# Altium schematic sheet POWER_2.5V_3A.SchDoc
size A4
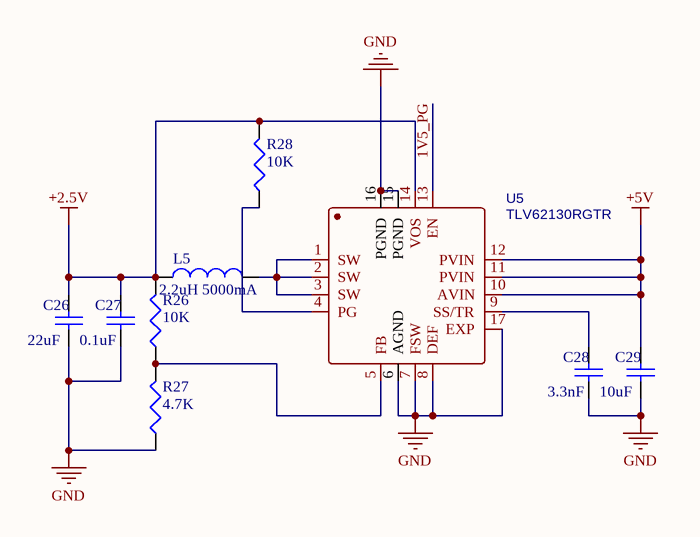
[diagram p0: POWER_2.5V_3A.SchDoc]

## Parts
C26  value 22uF  [C1210]  (hidden comment: Cap Semi)
C27  value 0.1uF  [C1210]  (hidden comment: Cap Semi)
C28  value 3.3nF  [C1210]  (hidden comment: Cap Semi)
C29  value 10uF  [C1210]  (hidden comment: Cap Semi)
L5  value 2.2uH 5000mA  [IND-SMD_L5.5-W5.2]  (hidden comment: Inductor)
R26  value 10K  [J1-0603]  (hidden comment: Res3)
R27  value 4.7K  [J1-0603]  (hidden comment: Res3)
R28  value 10K  [J1-0603]  (hidden comment: Res3)
U5  TLV62130RGTR  [QFN-16]

## Nets
+2.5V: C26.2 C27.2 L5.1 R26.2 R28.2 U5.14(VOS)
+5V: C29.2 U5.10(AVIN) U5.11(PVIN) U5.12(PVIN)
GND: C26.1 C27.1 C28.1 C29.1 R27.1 U5.6(AGND) U5.7(FSW) U5.8(DEF) U5.15(PGND) U5.16(PGND) U5.17(EXP)
1V5_PG: U5.13(EN)
NetC28_2: C28.2 U5.9(SS/TR)
NetL5_2: L5.2 U5.1(SW) U5.2(SW) U5.3(SW)
NetR26_1: R26.1 R27.2 U5.5(FB)
NetR28_1: R28.1 U5.4(PG)

## Library data of the parts
C26-C29 = Cap Semi: Capacitor (Semiconductor SIM Model); Published: 8-Jun-2000; LatestRevisionDate: 29-May-2009; LatestRevisionNote: IPC-7351 Footprint Added.; PackageReference: C1206; Publisher: Altium Limited; PackageDescription: Chip Capacitor
L5 = Inductor: Code_IEC: 1005; Published: 8-Jun-2000; LatestRevisionDate: 29-May-2009; LatestRevisionNote: IPC-7351 Footprint Added.; PackageReference: 0402-A; Publisher: Altium Limited; PackageDescription: Chip Inductor; Code_JEITA: 0402
R26-R28 = Res3: Resistor; Published: 8-Jun-2000; LatestRevisionDate: 29-May-2009; LatestRevisionNote: IPC-7351 Footprint Added.; PackageReference: J1-0603; Publisher: Altium Limited; PackageDescription: Chip Resistor
U5 = TLV62130RGTR: BOM_Manufacturer: TI; Contributor: LCSC; SMT Type: Extend; BOM_Supplier: LCSC; BOM_Manufacturer Part: TLV62130RGTR; BOM_Supplier Part: C122479; BOM_LCSC Assembly: Yes; spicePre: U; spiceSymbolName: TLV62130RGTR